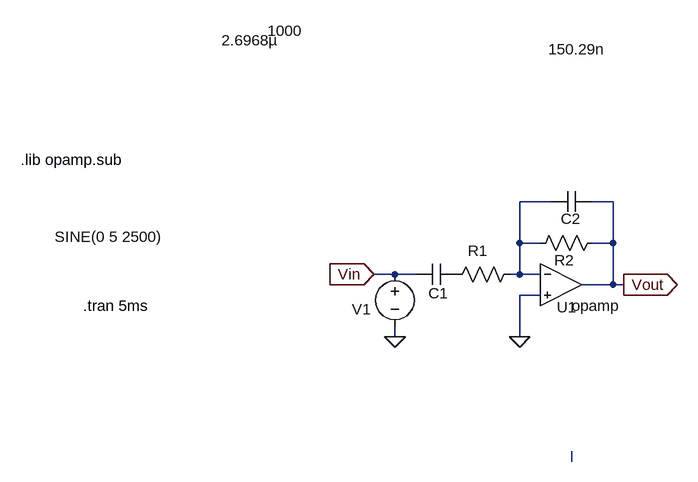
[diagram p0: schematic BP2order.asc]
BP2order.asc, the LTspice schematic file:
Version 4
SHEET 1 880 752
WIRE 432 192 384 192
WIRE 528 192 496 192
WIRE 384 256 384 192
WIRE 416 256 384 256
WIRE 528 256 528 192
WIRE 528 256 496 256
WIRE 192 304 160 304
WIRE 224 304 192 304
WIRE 384 304 384 256
WIRE 384 304 368 304
WIRE 416 304 384 304
WIRE 528 320 528 256
WIRE 528 320 480 320
WIRE 544 320 528 320
WIRE 416 336 384 336
WIRE 192 400 192 384
WIRE 384 400 384 336
WIRE 464 592 464 576
FLAG 192 400 0
FLAG 544 320 Vout
IOPIN 544 320 Out
FLAG 160 304 Vin
IOPIN 160 304 In
FLAG 384 400 0
SYMBOL res 272 320 R270
WINDOW 0 37 48 VTop 2
WINDOW 3 406 -249 VBottom 2
SYMATTR InstName R1
SYMATTR Value 1000
SYMATTR SpiceLine tol=1 pwr=0.1
SYMBOL OpAmps\\opamp 448 256 R0
WINDOW 0 -7 99 Left 2
SYMATTR InstName U1
SYMBOL res 512 240 R90
WINDOW 0 58 59 VBottom 2
WINDOW 3 32 56 Invisible 2
SYMATTR InstName R2
SYMATTR Value 1000
SYMATTR SpiceLine tol=1 pwr=0.1
SYMBOL voltage 192 288 R0
WINDOW 3 -524 -42 Left 2
WINDOW 123 -441 14 Left 2
WINDOW 39 0 0 Left 0
WINDOW 0 -66 70 Left 2
SYMATTR Value SINE(0 5 2500)
SYMATTR InstName V1
SYMBOL cap 288 288 R90
WINDOW 0 61 29 VBottom 2
WINDOW 3 -360 319 VTop 2
SYMATTR InstName C1
SYMATTR Value 2.6968µ
SYMBOL cap 496 176 R90
WINDOW 0 58 33 VBottom 2
WINDOW 3 -203 24 VBottom 2
SYMATTR InstName C2
SYMATTR Value 150.29n
TEXT -384 128 Left 2 !.lib opamp.sub
TEXT -288 352 Left 2 !.tran 5ms

The netlist it stands for:
* BP2order.asc
R1 P001 N001 1000 tol=1 pwr=0.1
XU1 N001 0 Vout opamp Aol=100K GBW=10Meg  ; pins invin noninvin out
R2 Vout N001 1000 tol=1 pwr=0.1
V1 Vin 0 SINE(0 5 2500)
C1 P001 Vin 2.6968µ
C2 Vout N001 150.29n
.lib opamp.sub
.tran 5ms
.backanno
.end